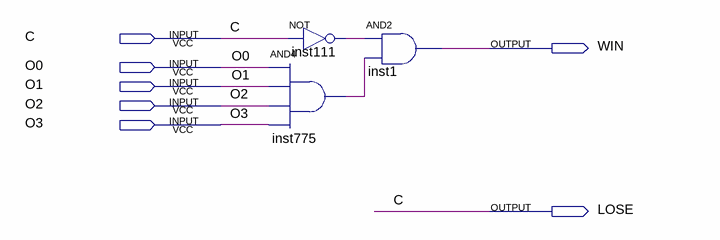
[diagram p0: schematic sheet]
// Quartus schematic win_lose.bdf as structural Verilog: 3 symbols, 7 pins
module win_lose (
  input  C,
  input  O0,
  input  O1,
  input  O2,
  input  O3,
  output WIN,
  output LOSE
);

  wire inst111_out, inst775_out;

  not inst111 (inst111_out, C);
  and inst775 (inst775_out, O0, O1, O2, O3);
  and inst1 (WIN, inst111_out, inst775_out);

  assign LOSE = C;
endmodule
